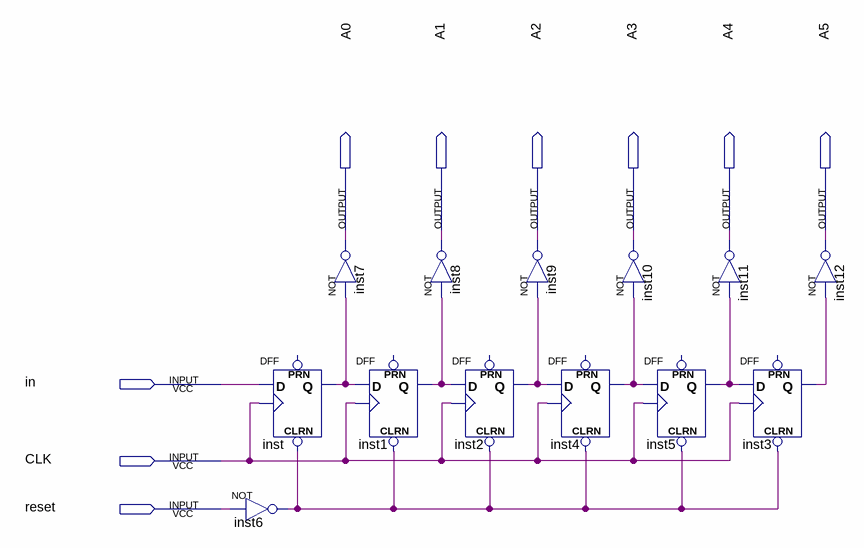
[diagram p0: schematic sheet]
// Quartus schematic SIPO.bdf as structural Verilog: 13 symbols, 9 pins
module SIPO (
  input  in,
  input  CLK,
  input  reset,
  output A0,
  output A1,
  output A2,
  output A3,
  output A4,
  output A5
);

  wire inst1_q, inst2_q, inst3_q, inst4_q, inst5_q, inst6_out, inst_q;

  not inst6 (inst6_out, reset);
  DFF inst (.CLRN(inst6_out), .CLK(CLK), .D(in), .Q(inst_q));  // open: PRN
  not inst7 (A0, inst_q);
  DFF inst1 (.CLRN(inst6_out), .CLK(CLK), .D(inst_q), .Q(inst1_q));  // open: PRN
  not inst8 (A1, inst1_q);
  DFF inst2 (.CLRN(inst6_out), .CLK(CLK), .D(inst1_q), .Q(inst2_q));  // open: PRN
  not inst9 (A2, inst2_q);
  not inst10 (A3, inst4_q);
  DFF inst4 (.CLRN(inst6_out), .CLK(CLK), .D(inst2_q), .Q(inst4_q));  // open: PRN
  DFF inst5 (.CLRN(inst6_out), .CLK(CLK), .D(inst4_q), .Q(inst5_q));  // open: PRN
  not inst11 (A4, inst5_q);
  DFF inst3 (.CLRN(inst6_out), .CLK(CLK), .D(inst5_q), .Q(inst3_q));  // open: PRN
  not inst12 (A5, inst3_q);
endmodule
